# EAGLE design monterra_board (EAGLE 7.2.0)
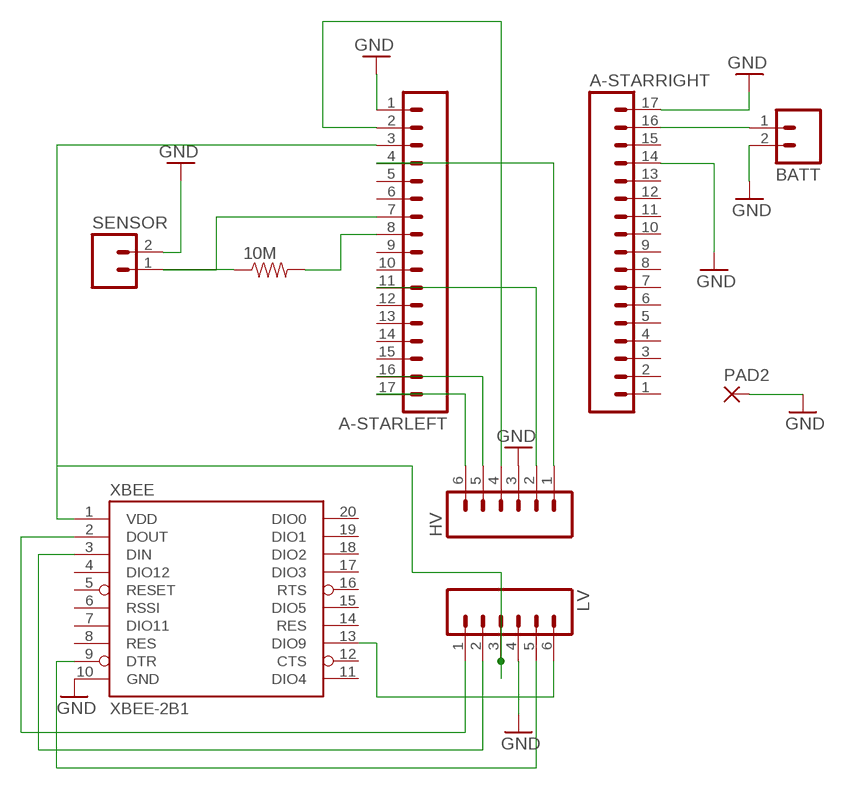
[diagram p0: schematic, sheet 1]

## Parts
10M  RESISTORAXIAL-0.3  [AXIAL-0.3]
A-STARLEFT  M17  [1X17]
A-STARRIGHT  M17  [1X17]
BATT  M02PTH  [1X02]
HV  M06SILK_FEMALE_PTH  [1X06]
LV  M06SILK_FEMALE_PTH  [1X06]
PAD2  3,81/1,7  [3,81/1,7]
SENSOR  M02PTH  [1X02]
XBEE  XBEE-2B1  [XBEE-1]

## Nets
GND: A-STARLEFT.1 A-STARRIGHT.14 A-STARRIGHT.17 BATT.2 HV.3 LV.4 PAD2.1(P) SENSOR.2 XBEE.10(GND)
N$1: 10M.P$2 A-STARLEFT.8
N$2: 10M.P$1 A-STARLEFT.7 SENSOR.1
N$3: A-STARLEFT.2 HV.4
N$4: A-STARLEFT.17 HV.6
N$5: A-STARLEFT.16 HV.5
N$6: A-STARLEFT.11 HV.2
N$7: A-STARLEFT.4 HV.1
N$8: A-STARRIGHT.16 BATT.1
N$9: A-STARLEFT.3 LV.3 XBEE.1(VDD)
N$10: LV.1 XBEE.2(DOUT)
N$11: LV.2 XBEE.3(DIN)
N$12: LV.5 XBEE.9(DTR)
N$13: LV.6 XBEE.13(DIO9)
Unconnected: A-STARLEFT.5 A-STARLEFT.6 A-STARLEFT.9 A-STARLEFT.10 A-STARLEFT.12 A-STARLEFT.13 A-STARLEFT.14 A-STARLEFT.15 A-STARRIGHT.1 A-STARRIGHT.2 A-STARRIGHT.3 A-STARRIGHT.4 A-STARRIGHT.5 A-STARRIGHT.6 A-STARRIGHT.7 A-STARRIGHT.8 A-STARRIGHT.9 A-STARRIGHT.10 A-STARRIGHT.11 A-STARRIGHT.12 A-STARRIGHT.13 A-STARRIGHT.15 XBEE.4(DIO12) XBEE.5(RESET) XBEE.6(RSSI) XBEE.7(DIO11) XBEE.8(RES) XBEE.11(DIO4) XBEE.12(CTS) XBEE.14(RES) XBEE.15(DIO5) XBEE.16(RTS) XBEE.17(DIO3) XBEE.18(DIO2) XBEE.19(DIO1) XBEE.20(DIO0)

## Library data of the parts
10M = SparkFun-Resistors:RESISTOR: Resistor Basic schematic elements and footprints for 0603, 1206, and PTH resistors.; MPN: MCF 0.25W 10M; OC_NEWARK: 26M1133
A-STARLEFT A-STARRIGHT = SparkFun-Connectors:M17: 1x17 .1" header; MPN: SLW-117-01-T-S; OC_NEWARK: 11P6937
BATT SENSOR = SparkFun-Connectors:M02: Standard 2-pin 0.1" header. Use with - straight break away headers ( PRT-00116) - right angle break away headers (PRT-00553) - swiss pins (PRT-00743) - machine pins (PRT-00117) - female headers (PRT-00115) Molex polarized connector foot print use with: PRT-08233 with associated crimp pins and housings. 2.54_SCREWTERM for use with PRT-10571. 3.5mm Screw Terminal footprints for PRT-08084 5mm Screw Terminal footprints for use with PRT-08432; OC_NEWARK: unknown
HV LV = SparkFun-Connectors:M06: Header 6 Standard 6-pin 0.1" header. Use with straight break away headers (SKU : PRT-00116), right angle break away headers (PRT-00553), swiss pins (PRT-00743), machine pins (PRT-00117), and female headers (PRT-00115). Molex polarized connector foot print use with SKU : PRT-08094 with associated crimp pins and housings. NOTES ON THE VARIANTS LOCK and LOCK_LONGPADS... This footprint was designed to help hold the alignment of a through-hole component (i.e. 6-pin header) while soldering it into place. You may notice that each hole has been shifted either up or down by 0.005 of an inch from it's more standard position (which is a perfectly straight line). This slight alteration caused the pins (the squares in the middle) to touch the edges of the holes. Because they are alternating, it causes a "brace" to hold the component in place. 0.005 has proven to be the perfect amount of "off-center" position when using our standard breakaway headers. Although looks a little odd when you look at the bare footprint, once you have a header in there, the alteration is very hard to notice. Also,if you push a header all the way into place, it is covered up entirely on the bottom side. This idea of altering the position of holes to aid alignment will be further integrated into the Sparkfun Library for other footprints. It can help hold any component with 3 or more connection pins.; OC_NEWARK: unknown; PROD_ID: CONN-08437
PAD2 = wirepad:3,81/1,7: THROUGH-HOLE PAD
XBEE = SparkFun-RF:XBEE-2: Xbee module footprints SMT header is CONN-09042.; OC_NEWARK: unknown

## Board
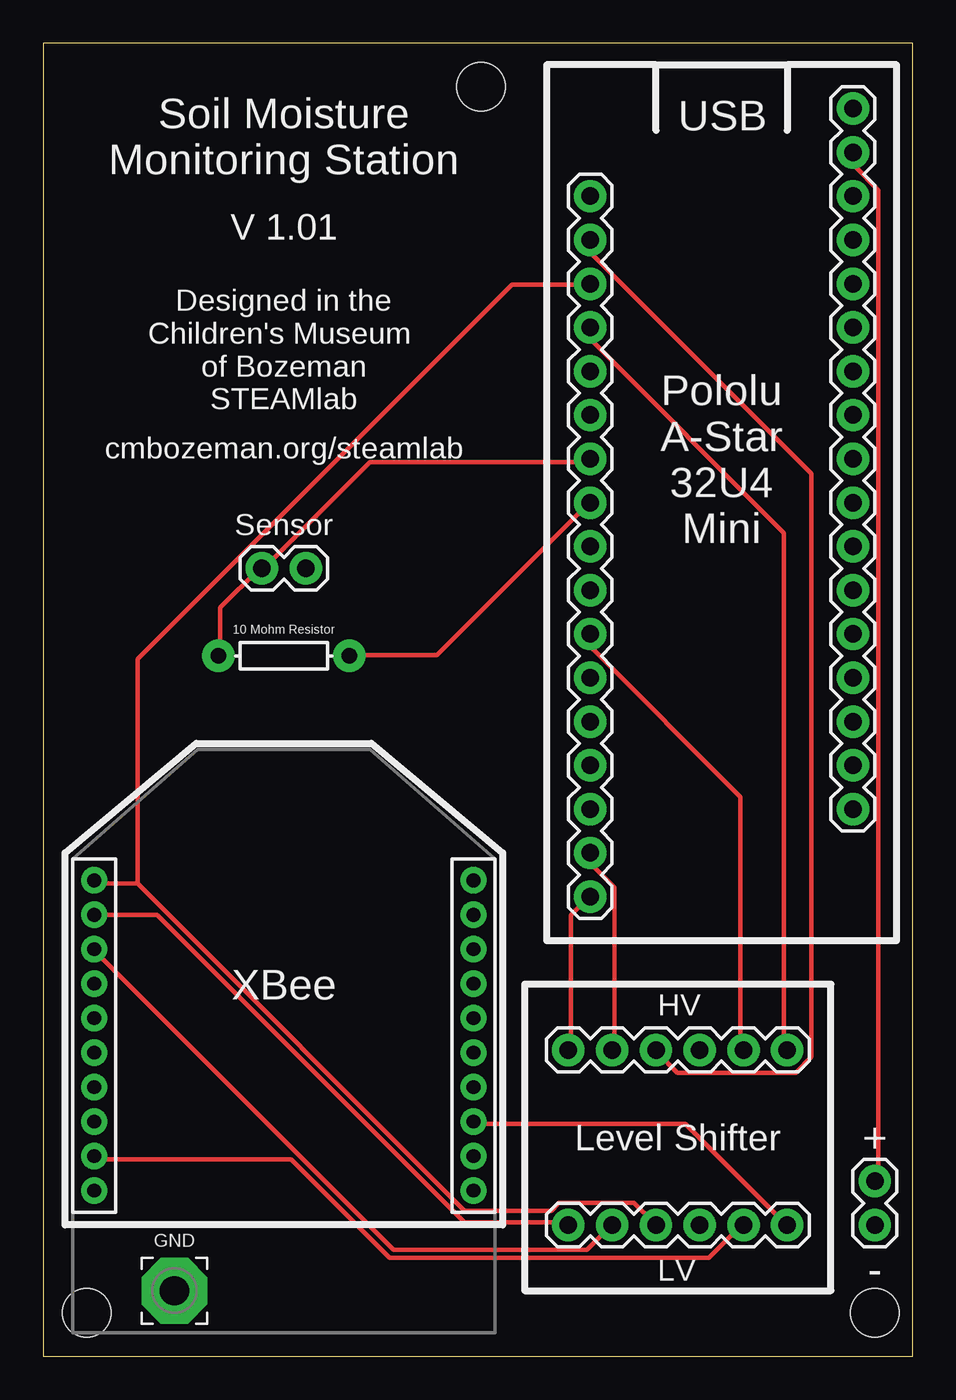
[diagram p1: board, top side]
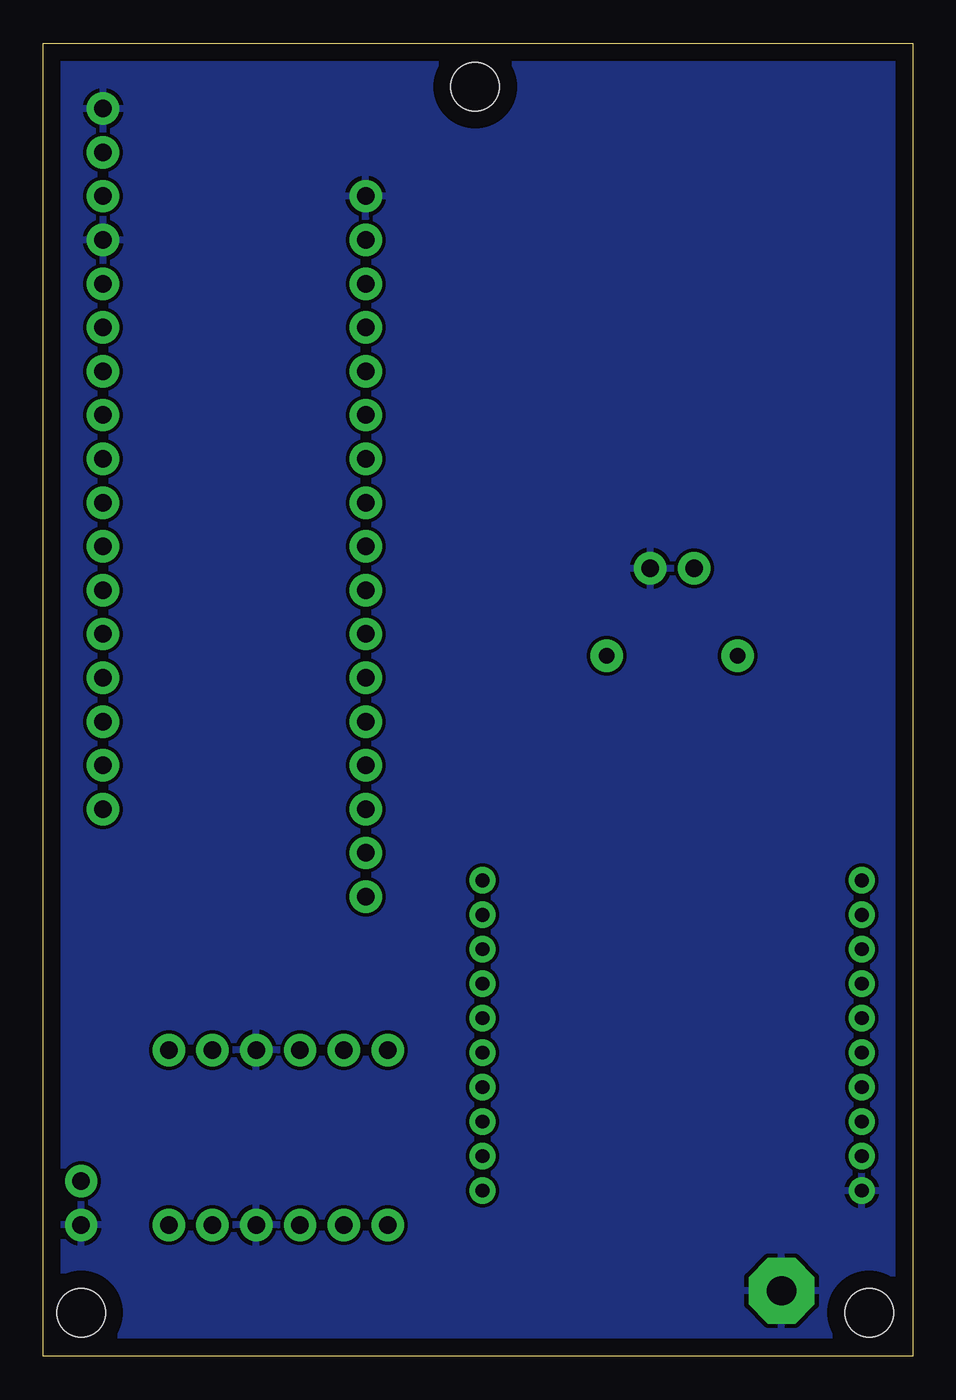
[diagram p2: board, bottom side, seen from below]

Size 50.47 x 76.19 mm. Coordinates in mm from the lower left corner, seen from the top.
Outline: 0,0 50.47,0 50.47,76.19 0,76.19 0,0
Copper layers (1*16): Top 0.035mm / dielectric 1.5mm / Bottom 0.035mm
Design rules "default": minimum track width 10mil, minimum drill 24mil, track to track 8mil, track to pad 8mil, pad to pad 8mil, via to via 8mil, smd to smd 8mil, copper to edge 40mil, drill to drill 8mil, minimum pad ring 10mil, minimum via ring 8mil, stop-mask expansion 4mil, vias tented up to drill 0mil, thermal gap 10mil
Holes 2.8 mm at 25.4,73.66 2.54,2.54 48.26,2.54

### Footprints (pad centres in the part's own frame; a part is rotated, then mirrored left to right if it is on the bottom)
AXIAL-0.3 = drill 0.9 pad 1.88: P$1 -3.81,0; P$2 3.81,0
1X17 = drill 1.016 pad 1.88: 1 0,0; 2 2.54,0; 3 5.08,0; 4 7.62,0; 5 10.16,0; 6 12.7,0; 7 15.24,0; 8 17.78,0; 9 20.32,0; 10 22.86,0; 11 25.4,0; 12 27.94,0; 13 30.48,0; 14 33.02,0; 15 35.56,0; 16 38.1,0; 17 40.64,0
1X02 = drill 1.016 pad 1.88: 1 0,0; 2 2.54,0
1X06 = drill 1.016 pad 1.88: 1 0,0; 2 2.54,0; 3 5.08,0; 4 7.62,0; 5 10.16,0; 6 12.7,0
3,81/1,7 = drill 1.7 pad 3.81 octagon: 1 0,0
XBEE-1 = drill 0.8 pad 1.524: 1 -11,20; 2 -11,18; 3 -11,16; 4 -11,14; 5 -11,12; 6 -11,10; 7 -11,8; 8 -11,6; 9 -11,4; 10 -11,2; 11 11,2; 12 11,4; 13 11,6; 14 11,8; 15 11,10; 16 11,12; 17 11,14; 18 11,16; 19 11,18; 20 11,20

### Placement (x,y rotation side)
10M  13.97,40.64 0 top
A-STARLEFT  31.75,67.31 270 top
A-STARRIGHT  46.99,31.75 90 top
BATT  48.26,10.16 270 top
HV  43.18,17.78 180 top
LV  30.48,7.62 0 top
PAD2  7.62,3.81 0 top
SENSOR  12.7,45.72 0 top
XBEE  13.97,7.62 0 top

### Tracks (layer width: path | path; a pad name or v marks a point on that pad's centre or on a via)
GND
  pour Bottom: -1.27,-1.27 -1.27,77.47 52.07,77.47 52.07,-1.27
N$1
  Top 0.254: 10M.P$2 17.83,40.69 22.86,40.69 31.55,49.38 A-STARLEFT.8
N$2
  Top 0.254: 10M.P$1 10.29,40.69 10.29,43.43 12.57,45.72 SENSOR.1 12.8,45.72 18.97,51.89 31.55,51.89 A-STARLEFT.7
N$3
  Top 0.254: A-STARLEFT.2 31.77,64.69 31.77,64.01 44.58,51.21 44.58,17.37 43.66,16.46 36.8,16.46 35.66,17.6 HV.4
N$4
  Top 0.254: HV.6 30.63,17.83 30.63,25.6 31.55,26.52 A-STARLEFT.17
N$5
  Top 0.254: A-STARLEFT.16 31.77,29.03 31.77,28.57 33.15,27.2 33.15,17.83 HV.5
N$6
  Top 0.254: A-STARLEFT.11 31.77,41.83 31.77,41.15 40.46,32.46 40.46,17.83 HV.2
N$7
  Top 0.254: A-STARLEFT.4 31.77,59.66 31.77,58.98 42.98,47.78 42.98,17.83 HV.1
N$8
  Top 0.254: A-STARRIGHT.16 47.09,69.72 47.09,69.04 48.46,67.67 48.46,10.29 BATT.1
N$9
  Top 0.254: 5.49,27.43 2.97,27.43 XBEE.1 | 5.49,27.43 24.46,8.46 29.49,8.46 29.95,8.91 34.29,8.91 35.43,7.77 LV.3 | 5.49,27.43 5.49,40.46 27.2,62.18 31.55,62.18 A-STARLEFT.3
N$10
  Top 0.254: XBEE.2 2.97,25.6 6.63,25.6 24.46,7.77 30.4,7.77 LV.1
N$11
  Top 0.254: XBEE.3 2.97,23.55 20.34,6.17 31.55,6.17 32.92,7.54 LV.2
N$12
  Top 0.254: XBEE.9 2.97,11.43 14.4,11.43 20.12,5.71 38.63,5.71 40.46,7.54 LV.5
N$13
  Top 0.254: XBEE.13 25.15,13.49 37.26,13.49 42.98,7.77 LV.6

### Text on the board
tPlace: USB | Soil Moisture / Monitoring Station | V 1.01 | Designed in the / Children's Museum / of Bozeman / STEAMlab | cmbozeman.org/steamlab | Pololu / A-Star / 32U4 / Mini | Sensor | 10 Mohm Resistor | XBee | Level Shifter | + | GND | -